# Altium schematic sheet PATHOS_SOM_IO.SchDoc: EFS SOM IO
size A3; Author: A. Kalberer; CompanyName: NTB; Organization: NTB Interstate University of Applied; Address1: Werdenbergstrasse 4; Address3: 9471 Buchs; Address4: Switzerland; Organization1: Sciences of Technology Buchs; Size: A3; ShortDescription: SOM GMI-Bus, FPGA Config
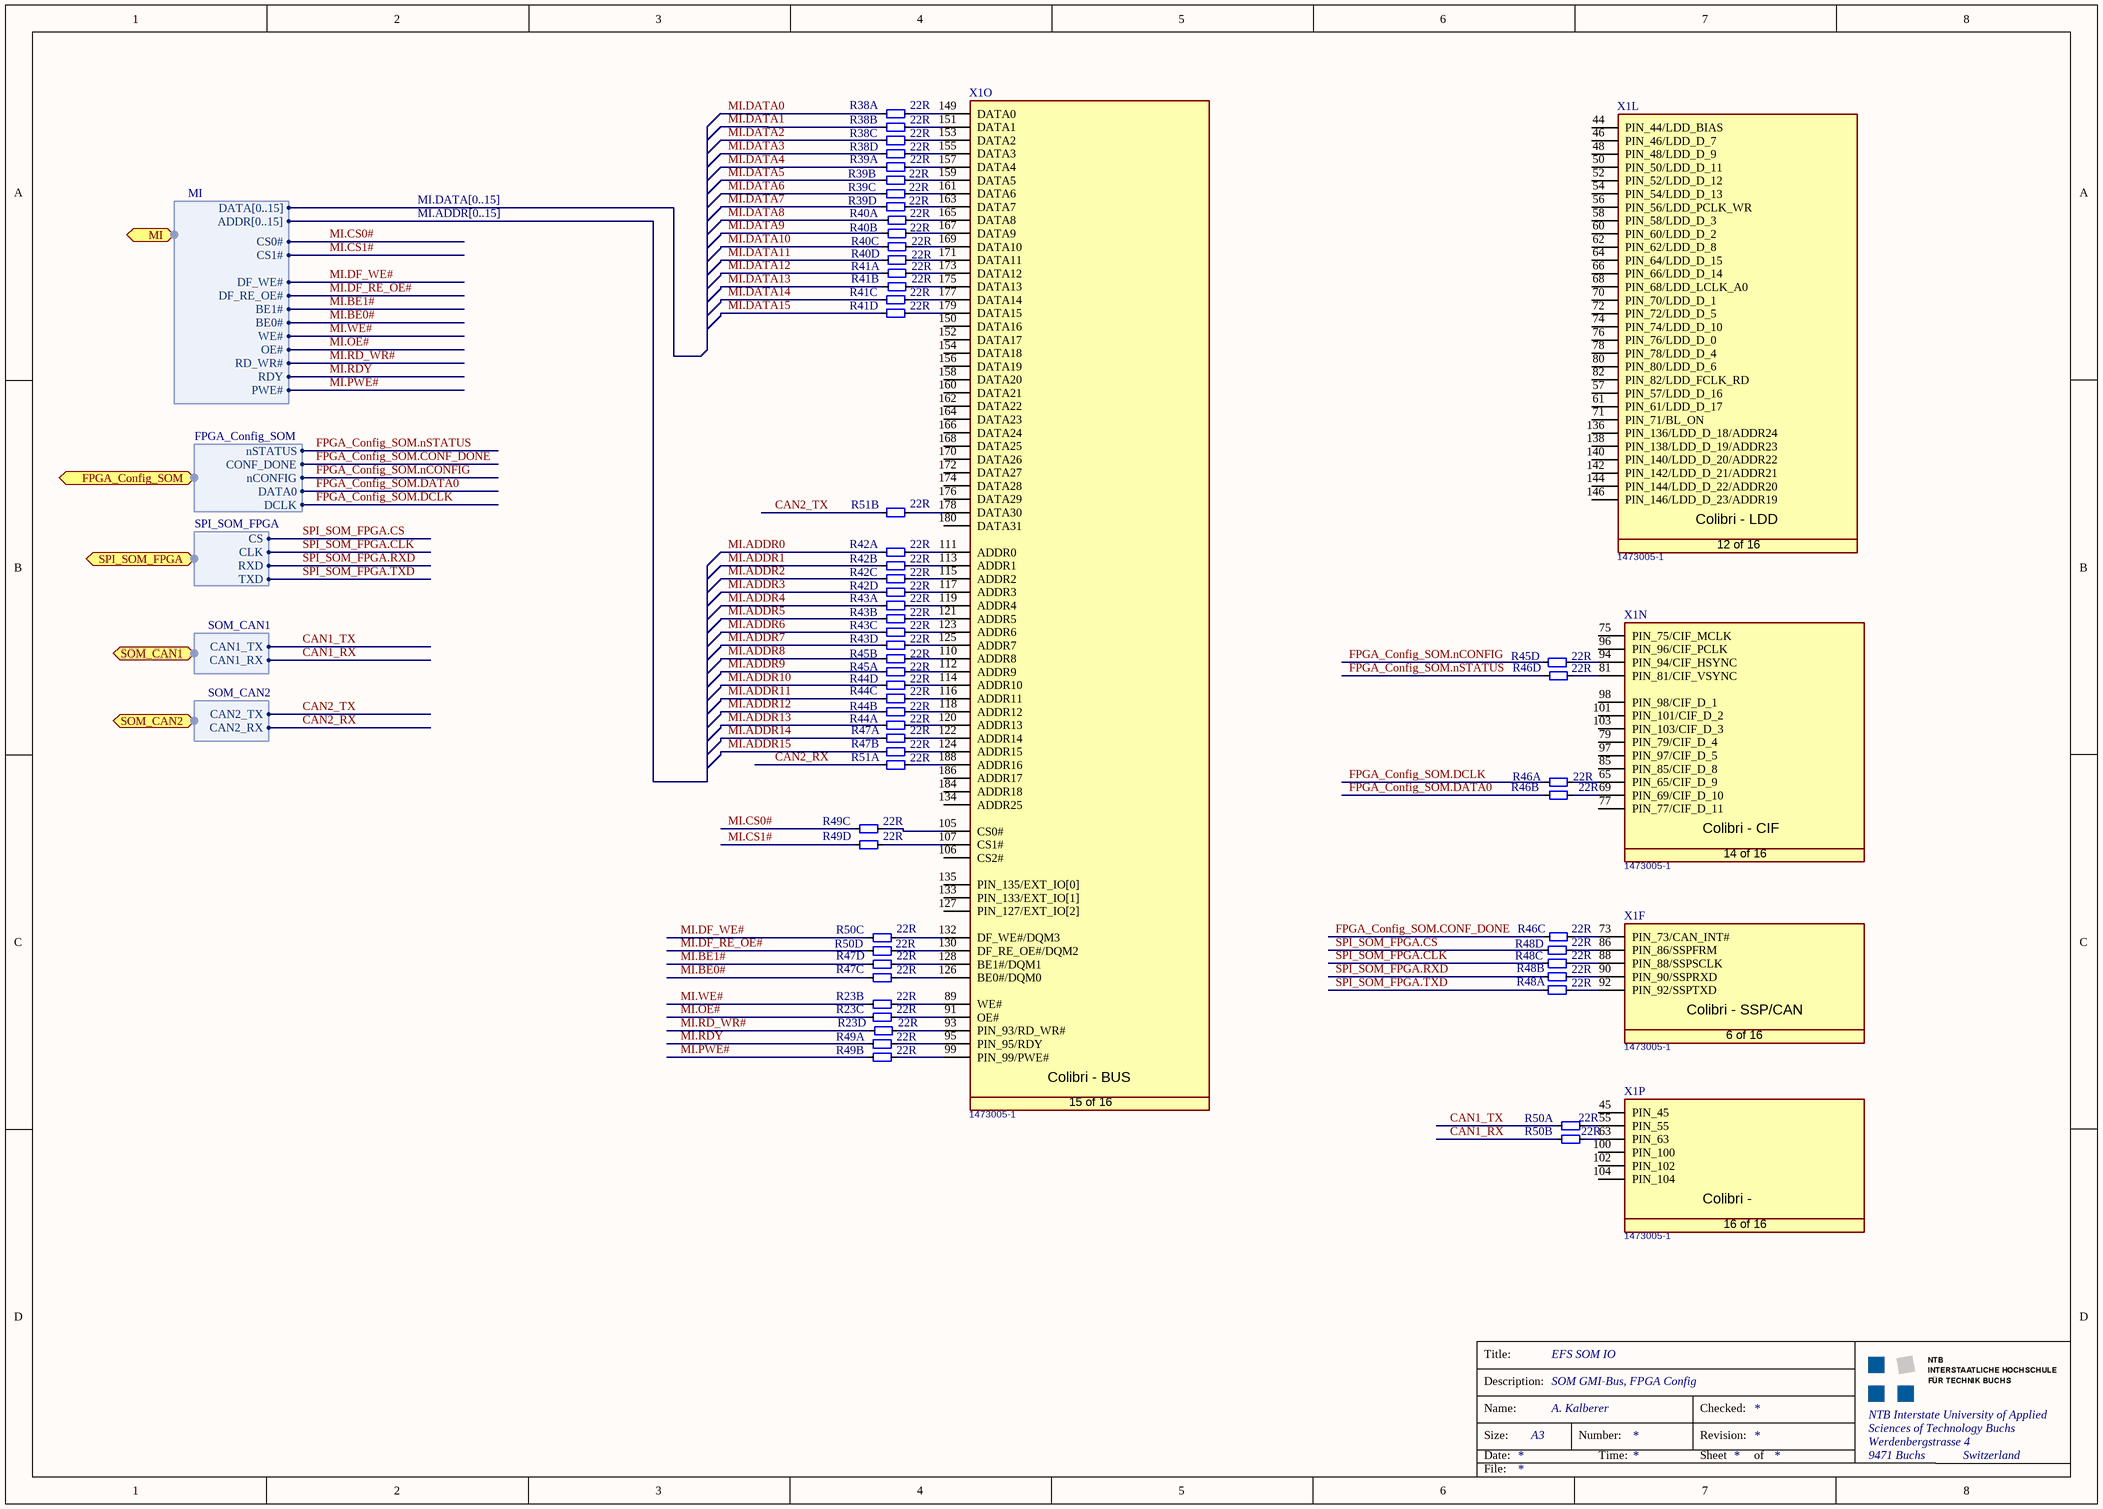
[diagram p0: PATHOS_SOM_IO.SchDoc]

## Parts
R23  value 22R  [R_Array_CAT16-J4]  (hidden comment: R Array)  (parts B,C,D of 4)
R38  value 22R  [R_Array_CAT16-J4]  (hidden comment: R Array)  (parts A,B,C,D of 4)
R39  value 22R  [R_Array_CAT16-J4]  (hidden comment: R Array)  (parts A,B,C,D of 4)
R40  value 22R  [R_Array_CAT16-J4]  (hidden comment: R Array)  (parts A,B,C,D of 4)
R41  value 22R  [R_Array_CAT16-J4]  (hidden comment: R Array)  (parts A,B,C,D of 4)
R42  value 22R  [R_Array_CAT16-J4]  (hidden comment: R Array)  (parts A,B,C,D of 4)
R43  value 22R  [R_Array_CAT16-J4]  (hidden comment: R Array)  (parts A,B,C,D of 4)
R44  value 22R  [R_Array_CAT16-J4]  (hidden comment: R Array)  (parts A,B,C,D of 4)
R45  value 22R  [R_Array_CAT16-J4]  (hidden comment: R Array)  (parts A,B,D of 4)
R46  value 22R  [R_Array_CAT16-J4]  (hidden comment: R Array)  (parts A,B,C,D of 4)
R47  value 22R  [R_Array_CAT16-J4]  (hidden comment: R Array)  (parts A,B,C,D of 4)
R48  value 22R  [R_Array_CAT16-J4]  (hidden comment: R Array)  (parts A,B,C,D of 4)
R49  value 22R  [R_Array_CAT16-J4]  (hidden comment: R Array)  (parts A,B,C,D of 4)
R50  value 22R  [R_Array_CAT16-J4]  (hidden comment: R Array)  (parts A,B,C,D of 4)
R51  value 22R  [R_Array_CAT16-J4]  (hidden comment: R Array)  (parts A,B of 4)
X1  Manufacturer Part No.: 1473005-1  [T_Tyco_1473005-1]  (hidden comment: CON-Tyco-1473005-1-200-0.6mm)  (parts F,L,N,O,P of 16)

## Ports
FPGA_Config_SOM (harness FPGA_Config_SOM), MI (harness MI), SOM_CAN1 (harness SOM_CAN1), SOM_CAN2 (harness SOM_CAN2), SPI_SOM_FPGA (harness SPI_SOM_FPGA)

## Harnesses
MI: DATA[0..15], ADDR[0..15], CS0#, DF_WE#, DF_RE_OE#, BE1#, BE0#, WE#, OE#, RD_WR#, RDY, PWE#, CS1#
FPGA_Config_SOM: DCLK, DATA0, nCONFIG, CONF_DONE, nSTATUS
SPI_SOM_FPGA: CS, CLK, RXD, TXD
SOM_CAN1: CAN1_TX, CAN1_RX
SOM_CAN2: CAN2_TX, CAN2_RX

## Nets
CAN1_RX: R50.2B ; port SOM_CAN1.CAN1_RX
CAN1_TX: R50.2A ; port SOM_CAN1.CAN1_TX
CAN2_RX: R51.1A ; port SOM_CAN2.CAN2_RX
CAN2_TX: R51.1B ; port SOM_CAN2.CAN2_TX
FPGA_Config_SOM.CONF_DONE: R46.1C ; port FPGA_Config_SOM.CONF_DONE
FPGA_Config_SOM.DATA0: R46.1B ; port FPGA_Config_SOM.DATA0
FPGA_Config_SOM.DCLK: R46.1A ; port FPGA_Config_SOM.DCLK
FPGA_Config_SOM.nCONFIG: R45.1D ; port FPGA_Config_SOM.nCONFIG
FPGA_Config_SOM.nSTATUS: R46.1D ; port FPGA_Config_SOM.nSTATUS
MI.ADDR0: R42.1A
MI.ADDR1: R42.1B
MI.ADDR2: R42.1C
MI.ADDR3: R42.1D
MI.ADDR4: R43.1A
MI.ADDR5: R43.1B
MI.ADDR6: R43.1C
MI.ADDR7: R43.1D
MI.ADDR8: R45.1B
MI.ADDR9: R45.1A
MI.ADDR10: R44.1D
MI.ADDR11: R44.1C
MI.ADDR12: R44.1B
MI.ADDR13: R44.1A
MI.ADDR14: R47.1A
MI.ADDR15: R47.1B
MI.BE0#: R47.1C ; port MI.BE0#
MI.BE1#: R47.1D ; port MI.BE1#
MI.CS0#: R49.1C ; port MI.CS0#
MI.CS1#: R49.1D ; port MI.CS1#
MI.DATA0: R38.1A
MI.DATA1: R38.1B
MI.DATA2: R38.1C
MI.DATA3: R38.1D
MI.DATA4: R39.1A
MI.DATA5: R39.1B
MI.DATA6: R39.1C
MI.DATA7: R39.1D
MI.DATA8: R40.1A
MI.DATA9: R40.1B
MI.DATA10: R40.1C
MI.DATA11: R40.1D
MI.DATA12: R41.1A
MI.DATA13: R41.1B
MI.DATA14: R41.1C
MI.DATA15: R41.1D
MI.DF_RE_OE#: R50.1D ; port MI.DF_RE_OE#
MI.DF_WE#: R50.1C ; port MI.DF_WE#
MI.OE#: R23.1C ; port MI.OE#
MI.PWE#: R49.1B ; port MI.PWE#
MI.RD_WR#: R23.1D ; port MI.RD_WR#
MI.RDY: R49.1A ; port MI.RDY
MI.WE#: R23.1B ; port MI.WE#
SPI_SOM_FPGA.CLK: R48.1C ; port SPI_SOM_FPGA.CLK
SPI_SOM_FPGA.CS: R48.1D ; port SPI_SOM_FPGA.CS
SPI_SOM_FPGA.RXD: R48.1B ; port SPI_SOM_FPGA.RXD
SPI_SOM_FPGA.TXD: R48.1A ; port SPI_SOM_FPGA.TXD
NetR23_2B: R23.2B X1.89(WE#)
NetR23_2C: R23.2C X1.91(OE#)
NetR23_2D: R23.2D X1.93(PIN_93/RD_WR#)
NetR38_2A: R38.2A X1.149(DATA0)
NetR38_2B: R38.2B X1.151(DATA1)
NetR38_2C: R38.2C X1.153(DATA2)
NetR38_2D: R38.2D X1.155(DATA3)
NetR39_2A: R39.2A X1.157(DATA4)
NetR39_2B: R39.2B X1.159(DATA5)
NetR39_2C: R39.2C X1.161(DATA6)
NetR39_2D: R39.2D X1.163(DATA7)
NetR40_2A: R40.2A X1.165(DATA8)
NetR40_2B: R40.2B X1.167(DATA9)
NetR40_2C: R40.2C X1.169(DATA10)
NetR40_2D: R40.2D X1.171(DATA11)
NetR41_2A: R41.2A X1.173(DATA12)
NetR41_2B: R41.2B X1.175(DATA13)
NetR41_2C: R41.2C X1.177(DATA14)
NetR41_2D: R41.2D X1.179(DATA15)
NetR42_2A: R42.2A X1.111(ADDR0)
NetR42_2B: R42.2B X1.113(ADDR1)
NetR42_2C: R42.2C X1.115(ADDR2)
NetR42_2D: R42.2D X1.117(ADDR3)
NetR43_2A: R43.2A X1.119(ADDR4)
NetR43_2B: R43.2B X1.121(ADDR5)
NetR43_2C: R43.2C X1.123(ADDR6)
NetR43_2D: R43.2D X1.125(ADDR7)
NetR44_2A: R44.2A X1.120(ADDR13)
NetR44_2B: R44.2B X1.118(ADDR12)
NetR44_2C: R44.2C X1.116(ADDR11)
NetR44_2D: R44.2D X1.114(ADDR10)
NetR45_2A: R45.2A X1.112(ADDR9)
NetR45_2B: R45.2B X1.110(ADDR8)
NetR45_2D: R45.2D X1.94(PIN_94/CIF_HSYNC)
NetR46_2A: R46.2A X1.65(PIN_65/CIF_D_9)
NetR46_2B: R46.2B X1.69(PIN_69/CIF_D_10)
NetR46_2C: R46.2C X1.73(PIN_73/CAN_INT#)
NetR46_2D: R46.2D X1.81(PIN_81/CIF_VSYNC)
NetR47_2A: R47.2A X1.122(ADDR14)
NetR47_2B: R47.2B X1.124(ADDR15)
NetR47_2C: R47.2C X1.126(BE0#/DQM0)
NetR47_2D: R47.2D X1.128(BE1#/DQM1)
NetR48_2A: R48.2A X1.92(PIN_92/SSPTXD)
NetR48_2B: R48.2B X1.90(PIN_90/SSPRXD)
NetR48_2C: R48.2C X1.88(PIN_88/SSPSCLK)
NetR48_2D: R48.2D X1.86(PIN_86/SSPFRM)
NetR49_2A: R49.2A X1.95(PIN_95/RDY)
NetR49_2B: R49.2B X1.99(PIN_99/PWE#)
NetR49_2C: R49.2C X1.105(CS0#)
NetR49_2D: R49.2D X1.107(CS1#)
NetR50_1A: R50.1A X1.55(PIN_55)
NetR50_1B: R50.1B X1.63(PIN_63)
NetR50_2C: R50.2C X1.132(DF_WE#/DQM3)
NetR50_2D: R50.2D X1.130(DF_RE_OE#/DQM2)
NetR51_2A: R51.2A X1.188(ADDR16)
NetR51_2B: R51.2B X1.178(DATA30)

Not connected (* = marked no-connect by the designer): X1 44(PIN_44/LDD_BIAS) 45(PIN_45) 46(PIN_46/LDD_D_7) 48(PIN_48/LDD_D_9) 50(PIN_50/LDD_D_11) 52(PIN_52/LDD_D_12) 54(PIN_54/LDD_D_13) 56(PIN_56/LDD_PCLK_WR) 57(PIN_57/LDD_D_16) 58(PIN_58/LDD_D_3) 60(PIN_60/LDD_D_2) 61(PIN_61/LDD_D_17) 62(PIN_62/LDD_D_8) 64(PIN_64/LDD_D_15) 66(PIN_66/LDD_D_14) 68(PIN_68/LDD_LCLK_A0) 70(PIN_70/LDD_D_1) 71(PIN_71/BL_ON) 72(PIN_72/LDD_D_5) 74(PIN_74/LDD_D_10) 75(PIN_75/CIF_MCLK) 76(PIN_76/LDD_D_0) 77(PIN_77/CIF_D_11) 78(PIN_78/LDD_D_4) 79(PIN_79/CIF_D_4) 80(PIN_80/LDD_D_6) 82(PIN_82/LDD_FCLK_RD) 85(PIN_85/CIF_D_8) 96(PIN_96/CIF_PCLK) 97(PIN_97/CIF_D_5) 98(PIN_98/CIF_D_1) 100(PIN_100) 101(PIN_101/CIF_D_2) 102(PIN_102) 103(PIN_103/CIF_D_3) 104(PIN_104) 106(CS2#) 127(PIN_127/EXT_IO[2]) 133(PIN_133/EXT_IO[1]) 134(ADDR25) 135(PIN_135/EXT_IO[0]) 136(PIN_136/LDD_D_18/ADDR24) 138(PIN_138/LDD_D_19/ADDR23) 140(PIN_140/LDD_D_20/ADDR22) 142(PIN_142/LDD_D_21/ADDR21) 144(PIN_144/LDD_D_22/ADDR20) 146(PIN_146/LDD_D_23/ADDR19) 150(DATA16) 152(DATA17) 154(DATA18) 156(DATA19) 158(DATA20) 160(DATA21) 162(DATA22) 164(DATA23) 166(DATA24) 168(DATA25) 170(DATA26) 172(DATA27) 174(DATA28) 176(DATA29) 180(DATA31) 184(ADDR18) 186(ADDR17)

## Buses and harness runs
bus MI.ADDR[0..15]
bus MI.DATA[0..15]

## Notes on the sheet
- Title:
- Description:
- Size:
- Date:
- Name:
- Number:
- Time:
- Revision:
- Sheet
- Checked:
- of
- File:
- (in symbol CON-Tyco-1473005-1-200-0.6mm, part F) Colibri - SSP/CAN; 6 of 16
- (in symbol CON-Tyco-1473005-1-200-0.6mm, part L) Colibri - LDD; 12 of 16
- (in symbol CON-Tyco-1473005-1-200-0.6mm, part N) Colibri - CIF; 14 of 16
- (in symbol CON-Tyco-1473005-1-200-0.6mm, part O) Colibri - BUS; 15 of 16
- (in symbol CON-Tyco-1473005-1-200-0.6mm, part P) Colibri -; 16 of 16

## Library data of the parts
R23 R38-R51 = R_Array
X1 = CON-Tyco-1473005-1-200-0.6mm: SODIMM Connector; Manufacturer Name: Tyco; No. of ways: 200